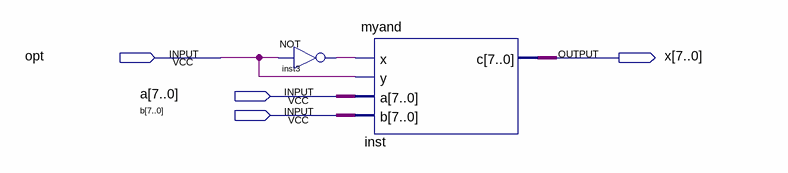
[diagram p0: schematic sheet]
// Quartus schematic twoOne.bdf as structural Verilog: 2 symbols, 4 pins
module twoOne (
  input  opt,
  input  [7:0] a,
  input  [7:0] b,
  output [7:0] x
);

  wire inst3_out;

  not inst3 (inst3_out, opt);
  myand inst (.x(inst3_out), .y(opt), .a(a), .b(b), .c(x));
endmodule
